# Altium schematic sheet EZ_FX3USB.SchDoc
size A
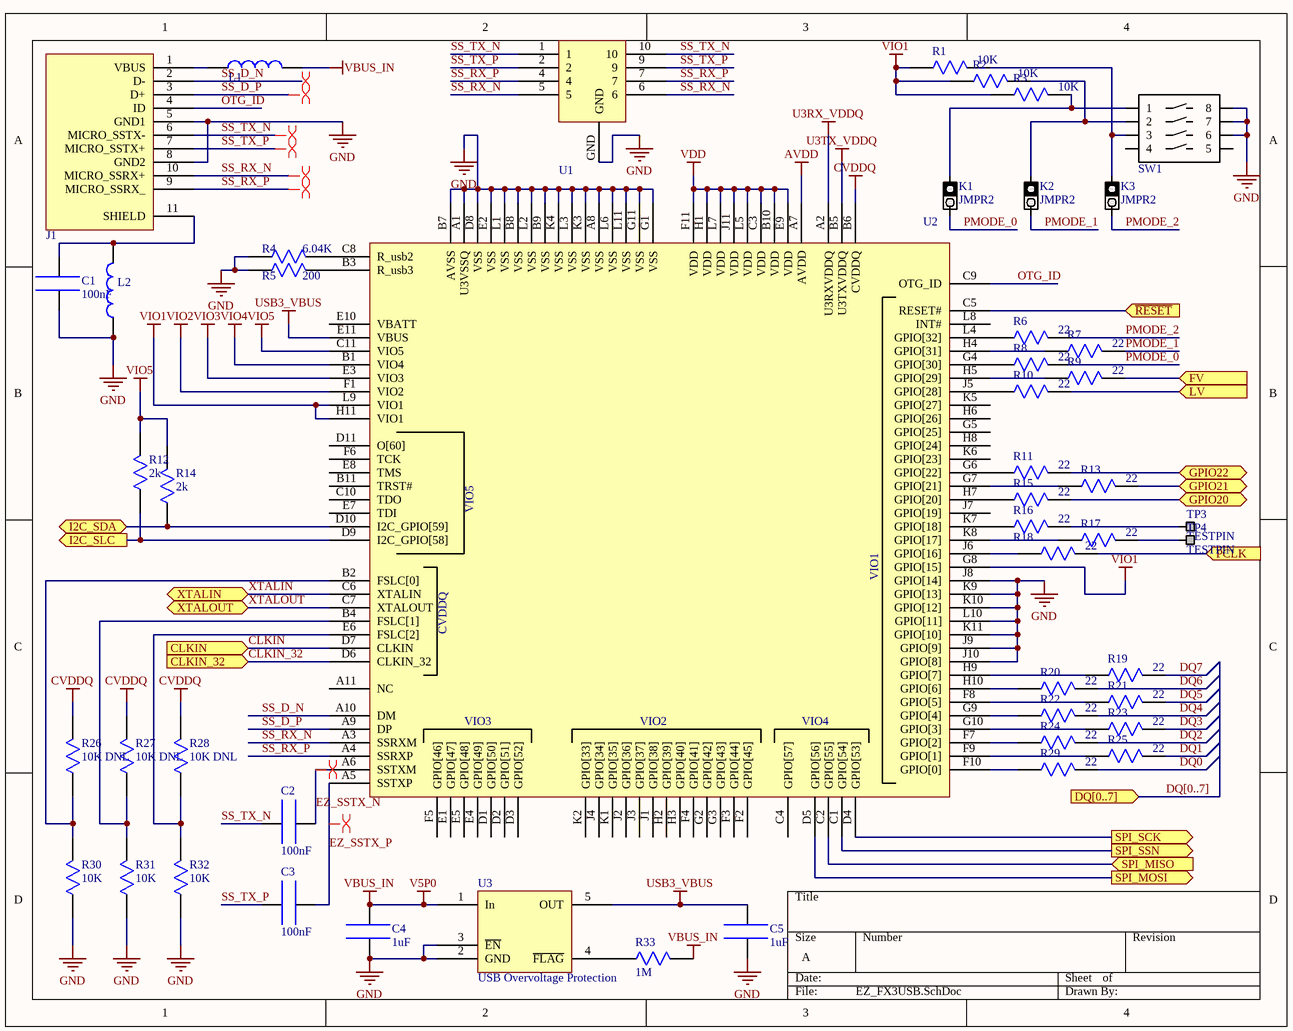
[diagram p0: EZ_FX3USB.SchDoc]

## Parts
C1  value 100nF  [SMD Capacitor 0603]  (hidden comment: Capacitor)
C2  value 100nF  [SMD Capacitor 0603]  (hidden comment: Capacitor)
C3  value 100nF  [SMD Capacitor 0603]  (hidden comment: Capacitor)
C4  value 1uF  [SMD Capacitor 0603]  (hidden comment: Capacitor)
C5  value 1uF  [SMD Capacitor 0603]  (hidden comment: Capacitor)
J1  USB3 MicroB  [PCBComponent_1]  (value not drawn)
K1  JMPR2  [JMPR2]
K2  JMPR2  [JMPR2]
K3  JMPR2  [JMPR2]
L1  Ferrite Bead  [BLM21PG221SN1D_0805]  (value not drawn)
L2  Ferrite Bead  [BLM21PG221SN1D_0805]  (value not drawn)
R1  10K  [SMD Resistor 0603]
R2  value 10K  [SMD Resistor 0603]  (hidden comment: Resistor)
R3  value 10K  [SMD Resistor 0603]  (hidden comment: Resistor)
R4  value 6.04K  [SMD Resistor 0603]  (hidden comment: Resistor)
R5  value 200  [SMD Resistor 0603]  (hidden comment: Resistor)
R6  value 22  [SMD Resistor 0603]  (hidden comment: "=Value")
R7  value 22  [SMD Resistor 0603]  (hidden comment: Resistor)
R8  value 22  [SMD Resistor 0603]  (hidden comment: Resistor)
R9  value 22  [SMD Resistor 0603]  (hidden comment: Resistor)
R10  value 22  [SMD Resistor 0603]  (hidden comment: Resistor)
R11  value 22  [SMD Resistor 0603]  (hidden comment: Resistor)
R12  value 2k  [SMD Resistor 0603]  (hidden comment: Resistor)
R13  value 22  [SMD Resistor 0603]  (hidden comment: Resistor)
R14  value 2k  [SMD Resistor 0603]  (hidden comment: Resistor)
R15  value 22  [SMD Resistor 0603]  (hidden comment: Resistor)
R16  value 22  [SMD Resistor 0603]  (hidden comment: Resistor)
R17  value 22  [SMD Resistor 0603]  (hidden comment: Resistor)
R18  value 22  [SMD Resistor 0603]  (hidden comment: Resistor)
R19  value 22  [SMD Resistor 0603]  (hidden comment: Resistor)
R20  value 22  [SMD Resistor 0603]  (hidden comment: Resistor)
R21  value 22  [SMD Resistor 0603]  (hidden comment: Resistor)
R22  value 22  [SMD Resistor 0603]  (hidden comment: Resistor)
R23  value 22  [SMD Resistor 0603]  (hidden comment: Resistor)
R24  value 22  [SMD Resistor 0603]  (hidden comment: Resistor)
R25  value 22  [SMD Resistor 0603]  (hidden comment: Resistor)
R26  value 10K DNL  [SMD Resistor 0603]  (hidden comment: Resistor)
R27  value 10K DNL  [SMD Resistor 0603]  (hidden comment: Resistor)
R28  value 10K DNL  [SMD Resistor 0603]  (hidden comment: Resistor)
R29  value 22  [SMD Resistor 0603]  (hidden comment: Resistor)
R30  value 10K  [SMD Resistor 0603]  (hidden comment: Resistor)
R31  value 10K  [SMD Resistor 0603]  (hidden comment: Resistor)
R32  value 10K  [SMD Resistor 0603]  (hidden comment: Resistor)
R33  value 1M  [SMD Resistor 0603]  (hidden comment: Resistor)
SW1  SW_DIP_4Position  [218-4LPST]  (value not drawn)
TP3  TESTPIN  [TESTPIN]
TP4  TESTPIN  [TESTPIN]
U1  ESD_4Channel  [SP3010-04UTG]  (value not drawn)
U2  EZ FX3 USB  [BGA121C80P11X11_1000X1000X100]  (value not drawn)
U3  USB Overvoltage Protection  [TSOP-5 _ NCP361SNT1G]

## Ports
CLKIN (in), CLKIN_32 (in), DQ[0..7] (in), FV (in), GPIO20 (bidir), GPIO21 (bidir), GPIO22 (bidir), I2C_SDA (bidir), I2C_SLC (out), LV (in), PCLK (in), SPI_MISO (in), SPI_MOSI (out), SPI_SCK (out), SPI_SSN (out), XTALIN, XTALOUT, ~{RESET} (in)

## Nets
AVDD: U2.A7(AVDD)
CVDDQ: R26.1 R27.1 R28.1 U2.B6(CVDDQ)
GND: C1.0 C4.0 C5.0 J1.5(GND1) J1.8(GND2) L2.1 R4.0 R5.0 R30.0 R31.0 R32.0 SW1.6 SW1.7 SW1.8 U1.GND U2.A1(U3VSSQ) U2.A8(VSS) U2.B7(AVSS) U2.B8(VSS) U2.B9(VSS) U2.D8(VSS) U2.E2(VSS) U2.G1(VSS) U2.G11(VSS) U2.J8(GPIO[14]) U2.J9(GPIO[9]) U2.J10(GPIO[8]) U2.K3(VSS) U2.K4(VSS) U2.K9(GPIO[13]) U2.K10(GPIO[12]) U2.K11(GPIO[10]) U2.L1(VSS) U2.L2(VSS) U2.L3(VSS) U2.L6(VSS) U2.L10(GPIO[11]) U2.L11(VSS) U3.2(GND) U3.3(~{EN})
U3RX_VDDQ: U2.A2(U3RXVDDQ)
U3TX_VDDQ: U2.B5(U3TXVDDQ)
USB3_VBUS: C5.1 U2.E11(VBUS) U3.5(OUT)
V5P0: C4.1 L1.2 R33.1 U3.1(In)  [also labelled VBUS_IN]
VDD: U2.B10(VDD) U2.C3(VDD) U2.E9(VDD) U2.F11(VDD) U2.H1(VDD) U2.J11(VDD) U2.L5(VDD) U2.L7(VDD)
VIO1: R1.0 R2.0 R3.0 U2.G8(GPIO[15]) U2.H11(VIO1) U2.L9(VIO1)
VIO2: U2.F1(VIO2)
VIO3: U2.E3(VIO3)
VIO4: U2.B1(VIO4)
VIO5: R12.1 R14.1 U2.C11(VIO5)
CLKIN: U2.D7(CLKIN) ; port CLKIN
CLKIN_32: U2.D6(CLKIN_32) ; port CLKIN_32
DQ0: R29.1
DQ1: R25.1
DQ2: R24.1
DQ3: R23.1
DQ4: R22.1
DQ5: R21.1
DQ6: R20.1
DQ7: R19.1
EZ_SSTX_N: C2.1 U2.A6(SSTXM)
EZ_SSTX_P: C3.1 U2.A5(SSTXP)
FV: R9.1 ; port FV
GPIO20: R15.1 ; port GPIO20
GPIO21: R13.1 ; port GPIO21
GPIO22: R11.1 ; port GPIO22
I2C_SDA: R14.0 U2.D10(I2C_GPIO[59]) ; port I2C_SDA
I2C_SLC: R12.0 U2.D9(I2C_GPIO[58]) ; port I2C_SLC
LV: R10.1 ; port LV
OTG_ID: J1.4(ID) U2.C9(OTG_ID)
PCLK: R18.1 ; port PCLK
PMODE_0: K1.2 R8.1
PMODE_1: K2.2 R7.1
PMODE_2: K3.2 R6.1
~{RESET}: U2.C5(RESET#) ; port ~{RESET}
SPI_MISO: U2.C2(GPIO[55]) ; port SPI_MISO
SPI_MOSI: U2.D5(GPIO[56]) ; port SPI_MOSI
SPI_SCK: U2.D4(GPIO[53]) ; port SPI_SCK
SPI_SSN: U2.C1(GPIO[54]) ; port SPI_SSN
SS_D_N: J1.2(D-) U2.A10(DM)
SS_D_P: J1.3(D+) U2.A9(DP)
SS_RX_N: J1.10(MICRO_SSRX+) U1.5 U1.6 U2.A3(SSRXM)
SS_RX_P: J1.9(MICRO_SSRX_) U1.4 U1.7 U2.A4(SSRXP)
SS_TX_N: C2.0 J1.6(MICRO_SSTX-) U1.1 U1.10
SS_TX_P: C3.0 J1.7(MICRO_SSTX+) U1.2 U1.9
XTALIN: U2.C6(XTALIN) ; port XTALIN
XTALOUT: U2.C7(XTALOUT) ; port XTALOUT
NetC1_1: C1.1 J1.11(SHIELD) L2.2
NetJ1_1: J1.1(VBUS) L1.1
NetK1_1: K1.1 R3.1 SW1.1
NetK2_1: K2.1 R2.1 SW1.2
NetK3_1: K3.1 R1.1 SW1.3
NetR4_1: R4.1 U2.C8(R_usb2)
NetR5_1: R5.1 U2.B3(R_usb3)
NetR6_0: R6.0 U2.L4(GPIO[32])
NetR7_0: R7.0 U2.H4(GPIO[31])
NetR8_0: R8.0 U2.G4(GPIO[30])
NetR9_0: R9.0 U2.H5(GPIO[29])
NetR10_0: R10.0 U2.J5(GPIO[28])
NetR11_0: R11.0 U2.G6(GPIO[22])
NetR13_0: R13.0 U2.G7(GPIO[21])
NetR15_0: R15.0 U2.H7(GPIO[20])
NetR16_0: R16.0 U2.K7(GPIO[18])
NetR16_1: R16.1 TP3.1
NetR17_0: R17.0 U2.K8(GPIO[17])
NetR17_1: R17.1 TP4.1
NetR18_0: R18.0 U2.J6(GPIO[16])
NetR19_0: R19.0 U2.H9(GPIO[7])
NetR20_0: R20.0 U2.H10(GPIO[6])
NetR21_0: R21.0 U2.F8(GPIO[5])
NetR22_0: R22.0 U2.G9(GPIO[4])
NetR23_0: R23.0 U2.G10(GPIO[3])
NetR24_0: R24.0 U2.F7(GPIO[2])
NetR25_0: R25.0 U2.F9(GPIO[1])
NetR26_0: R26.0 R30.1 U2.B2(FSLC[0])
NetR27_0: R27.0 R31.1 U2.B4(FSLC[1])
NetR28_0: R28.0 R32.1 U2.E6(FSLC[2])
NetR29_0: R29.0 U2.F10(GPIO[0])
NetR33_0: R33.0 U3.4(~{FLAG})

Not connected (* = marked no-connect by the designer): SW1 4 5; U2 A11(NC) B11(TRST#) C4(GPIO[57]) C10(TDO) D1(GPIO[50]) D2(GPIO[51]) D3(GPIO[52]) D11(O[60]) E1(GPIO[47]) E4(GPIO[49]) E5(GPIO[48]) E7(TDI) E8(TMS) E10(VBATT) F2(GPIO[45]) F3(GPIO[44]) F4(GPIO[41]) F5(GPIO[46]) F6(TCK) G2(GPIO[42]) G3(GPIO[43]) G5(GPIO[25]) H2(GPIO[39]) H3(GPIO[40]) H6(GPIO[26]) H8(GPIO[24]) J1(GPIO[38]) J2(GPIO[36]) J3(GPIO[37]) J4(GPIO[34]) J7(GPIO[19]) K1(GPIO[35]) K2(GPIO[33]) K5(GPIO[27]) K6(GPIO[23]) L8(INT#)

## Buses and harness runs
bus DQ[0..7] = port DQ[0..7]

## Layout directives
differential pair: EZ_SSTX_N, EZ_SSTX_P, SS_D_N, SS_D_P, SS_RX_N, SS_RX_P, SS_TX_N, SS_TX_P

## Library data of the parts
K1-K3 = JMPR2: JMPR2 OPEN BY DEFAULT; Manufacturer: Sullins Connector Solutions; Manufacturer Part Number: PBC36SAAN; Supplier 1: Digi-Key; Supplier Part Number 1: S1011E-36-ND; Reel: Open
R1 R6 = Resistor
  R1: Value: 10K
TP3 TP4 = TESTPIN: TESTPIN SINGLE PIN HEADER; Manufacturer 1: Sharon Long Industries; Manufacturer Part Number 1: Cut-it-yourself; Reel: TH; Supplier 1: Sharon Long Industries; Supplier 1 Part number: Cut-It-Yourself